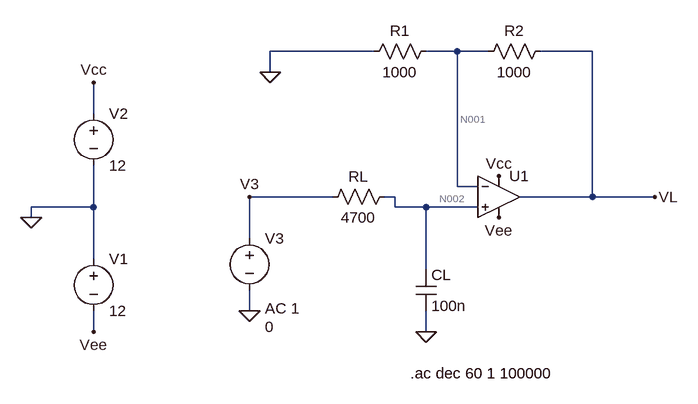
[diagram p0: schematic Draft5.asc]
Draft5.asc, the LTspice schematic file:
Version 4
SHEET 1 880 680
WIRE 32 -48 -128 -48
WIRE 160 -48 112 -48
WIRE 208 -48 160 -48
WIRE 368 -48 288 -48
WIRE -128 -16 -128 -48
WIRE -400 48 -400 0
WIRE 160 160 160 -48
WIRE 192 160 160 160
WIRE -32 176 -160 176
WIRE 64 176 48 176
WIRE 368 176 368 -48
WIRE 368 176 256 176
WIRE 464 176 368 176
WIRE -400 192 -400 128
WIRE -400 192 -496 192
WIRE 64 192 64 176
WIRE 112 192 64 192
WIRE 192 192 112 192
WIRE -496 208 -496 192
WIRE -160 240 -160 176
WIRE -400 272 -400 192
WIRE 112 288 112 192
WIRE -160 352 -160 320
WIRE -400 384 -400 352
WIRE 112 384 112 352
FLAG 112 384 0
FLAG -160 352 0
FLAG -128 -16 0
FLAG -496 208 0
FLAG -400 0 Vcc
FLAG 224 144 Vcc
FLAG -400 384 Vee
FLAG 224 208 Vee
FLAG 464 176 VL
FLAG -160 176 V3
SYMBOL OpAmps\\UniversalOpamp2 224 176 R0
SYMATTR InstName U1
SYMBOL voltage -400 256 R0
WINDOW 123 0 0 Left 0
WINDOW 39 0 0 Left 0
SYMATTR InstName V1
SYMATTR Value 12
SYMBOL voltage -400 32 R0
WINDOW 123 0 0 Left 0
WINDOW 39 0 0 Left 0
SYMATTR InstName V2
SYMATTR Value 12
SYMBOL voltage -160 224 R0
WINDOW 3 24 152 Left 2
WINDOW 123 24 124 Left 2
WINDOW 39 0 0 Left 0
SYMATTR Value 0
SYMATTR Value2 AC 1
SYMATTR InstName V3
SYMBOL res 128 -64 R90
WINDOW 0 0 56 VBottom 2
WINDOW 3 32 56 VTop 2
SYMATTR InstName R1
SYMATTR Value 1000
SYMBOL res 304 -64 R90
WINDOW 0 0 56 VBottom 2
WINDOW 3 32 56 VTop 2
SYMATTR InstName R2
SYMATTR Value 1000
SYMBOL res 64 160 R90
WINDOW 0 0 56 VBottom 2
WINDOW 3 32 56 VTop 2
SYMATTR InstName RL
SYMATTR Value 4700
SYMBOL cap 96 288 R0
SYMATTR InstName CL
SYMATTR Value 100n
TEXT 88 448 Left 2 !.ac dec 60 1 100000

The netlist it stands for:
* Draft5.asc
XU1 N002 N001 Vcc Vee VL level.2 Avol=1Meg GBW=10Meg Slew=10Meg ilimit=25m rail=0 Vos=0 phimargin=45 en=0 enk=0 in=0 ink=0 Rin=500Meg  ; pins IN+ IN- V+ V- OUT
V1 0 Vee 12
V2 Vcc 0 12
V3 V3 0 0 AC 1
R1 N001 0 1000
R2 VL N001 1000
RL N002 V3 4700
CL N002 0 100n
.ac dec 60 1 100000
.lib UniversalOpamps2.sub
.backanno
.end

* Results of the author's LTspice run, read from the files saved beside the schematic
* Operating Point, zero values left out:
*   V(vcc) = 12 V
*   V(vee) = -12 V
*   I(V2) = -1.199 mA
*   I(V1) = -1.199 mA
*   Ix(u1:3) = 1.199 mA
*   Ix(u1:4) = -1.199 mA
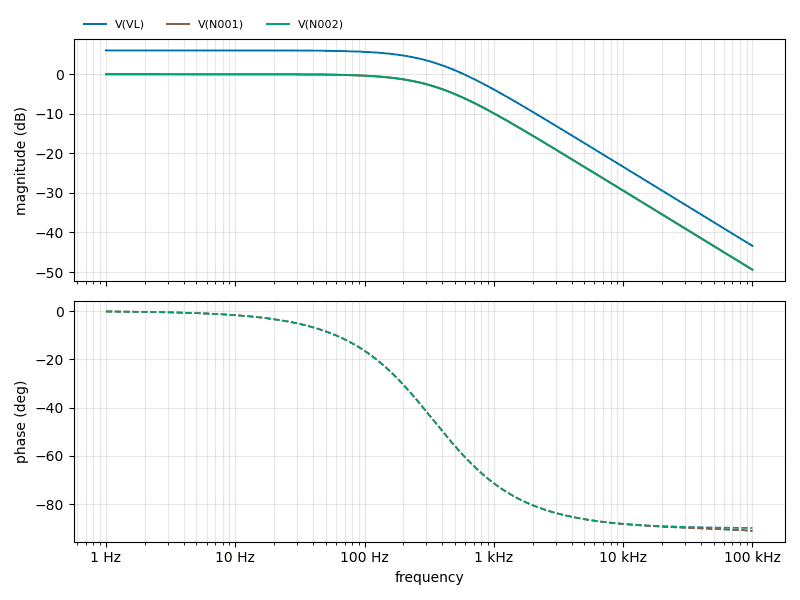
[diagram p1: AC Analysis of Draft5.asc, plotted from the saved traces]
* AC Analysis, 1 run:
*   V(VL): 6.02 dB at 1 Hz, -43.39 dB at 100 kHz, peak 6.02 dB at 1 Hz, 3 dB below the peak at 338.6 Hz
*   V(N001): -0.00 dB at 1 Hz, -49.41 dB at 100 kHz, peak -0.00 dB at 1 Hz, 3 dB below the peak at 338.6 Hz
*   V(N002): -0.00 dB at 1 Hz, -49.41 dB at 100 kHz, peak -0.00 dB at 1 Hz, 3 dB below the peak at 338.6 Hz